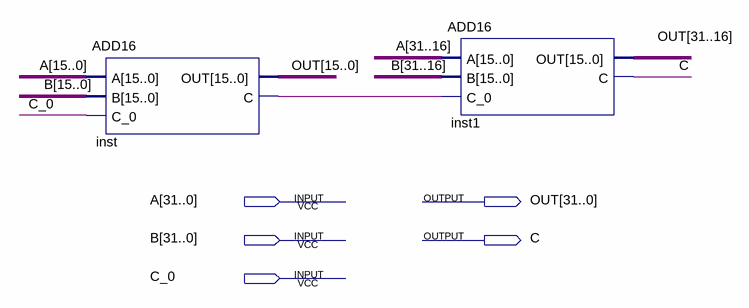
[diagram p0: schematic sheet]
// Quartus schematic ADD32.bdf as structural Verilog: 2 symbols, 5 pins
module ADD32 (
  input  [31:0] A,
  input  [31:0] B,
  input  C_0,
  output [31:0] OUT,
  output C
);

  wire inst_c;

  ADD16 inst (.A(A[15:0]), .B(B[15:0]), .C_0(C_0), .OUT(OUT[15:0]), .C(inst_c));
  ADD16 inst1 (.A(A[31:16]), .B(B[31:16]), .C_0(inst_c), .OUT(OUT[31:16]), .C(C));
endmodule
